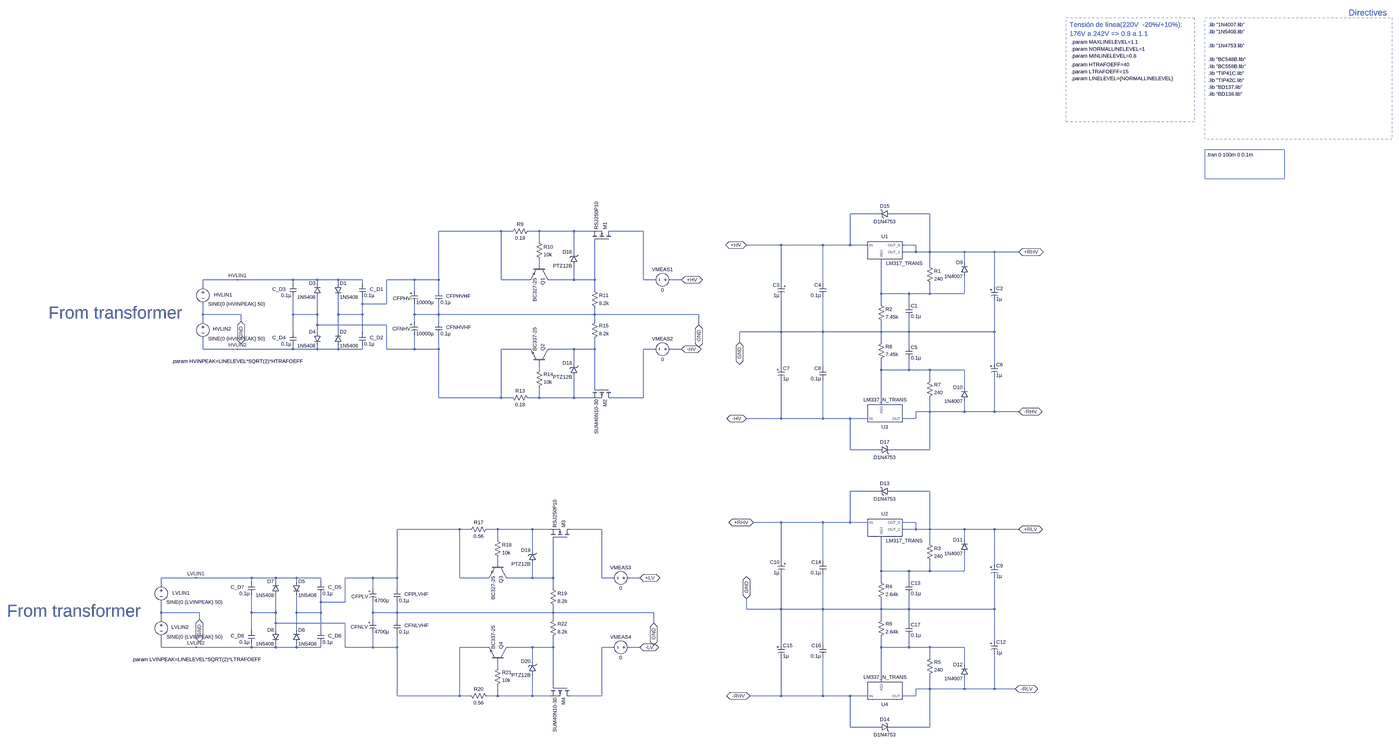
[diagram p0: schematic power_supply_V_1.0_BL.asc, whole sheet]
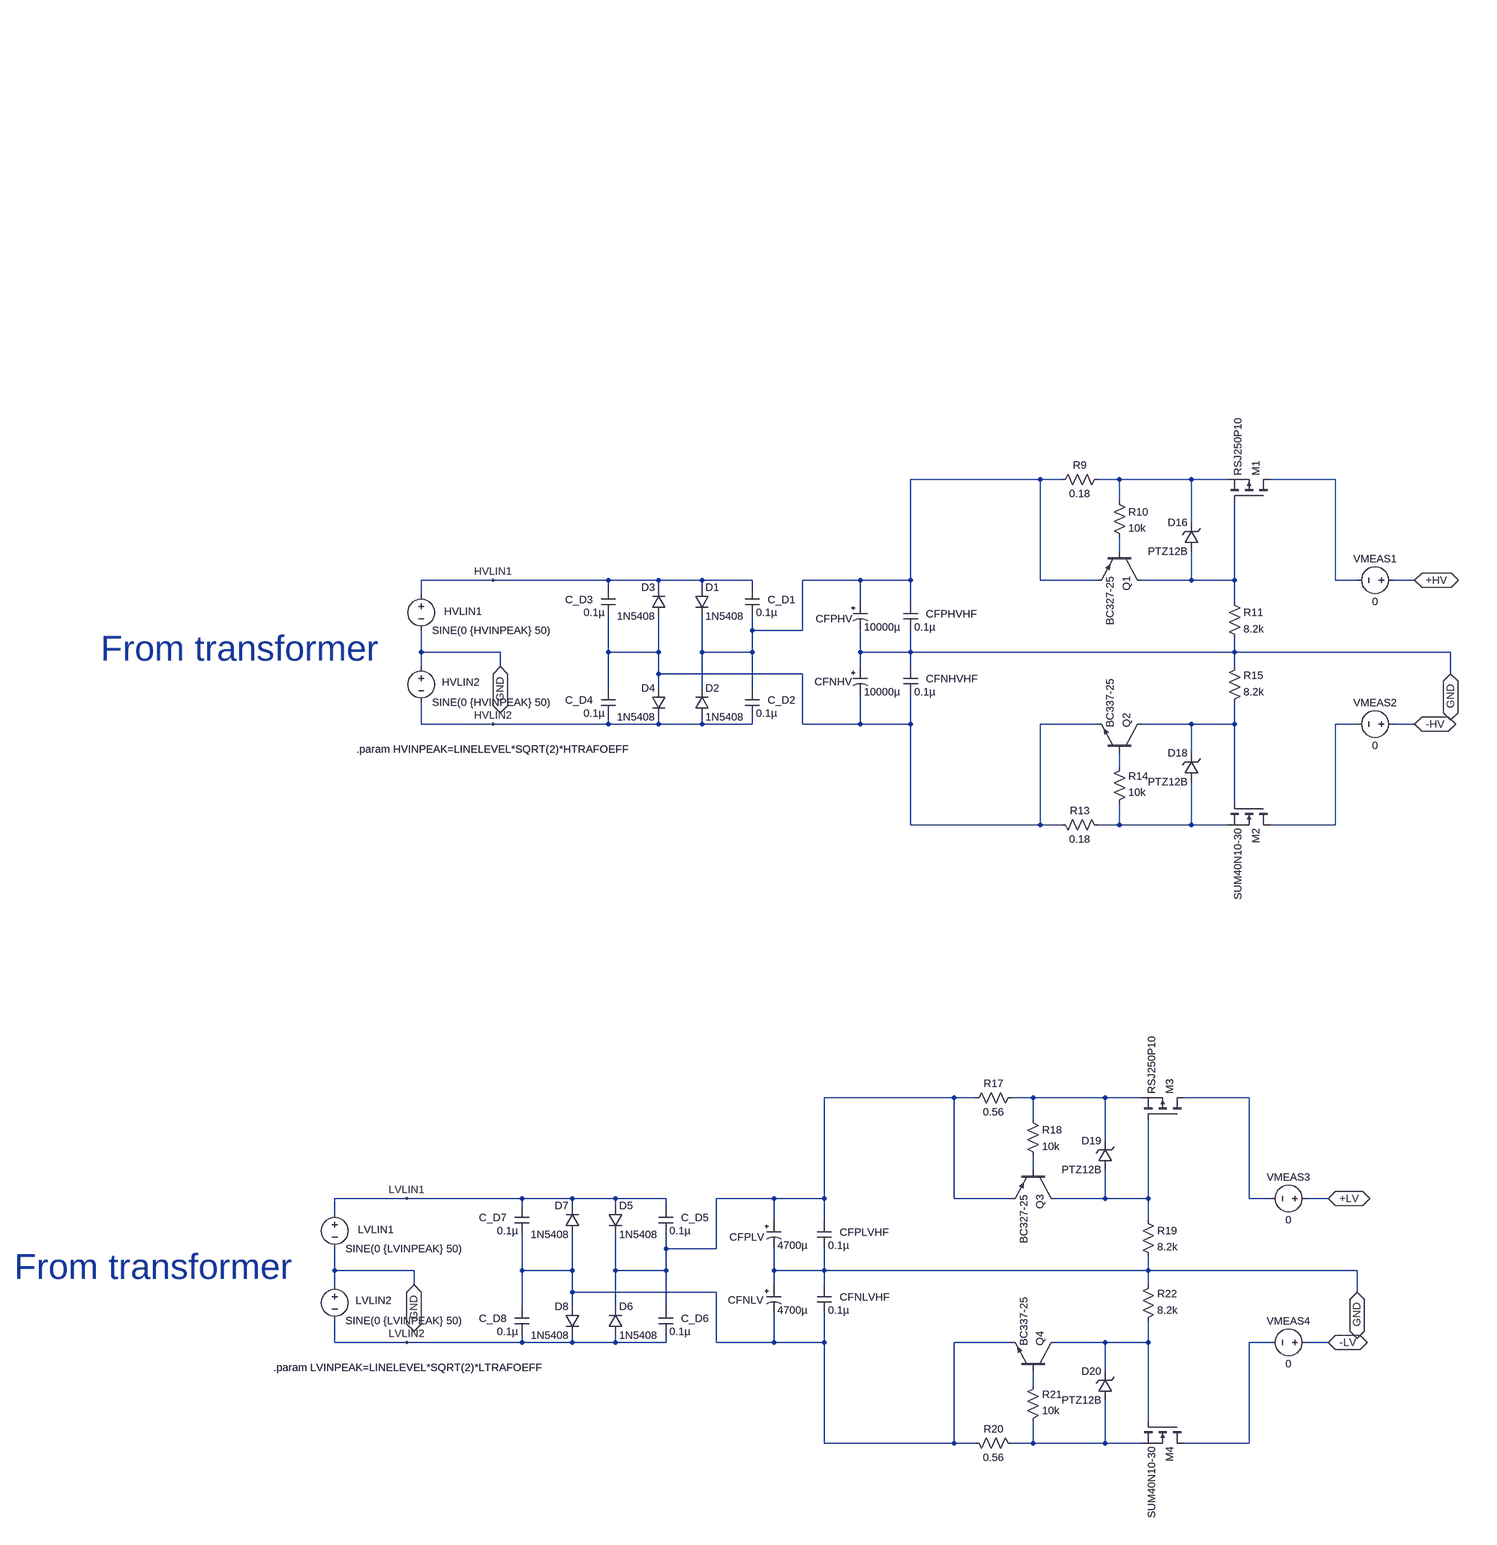
[diagram p1: schematic power_supply_V_1.0_BL.asc, part, row 1 of 1, column 1 of 2]
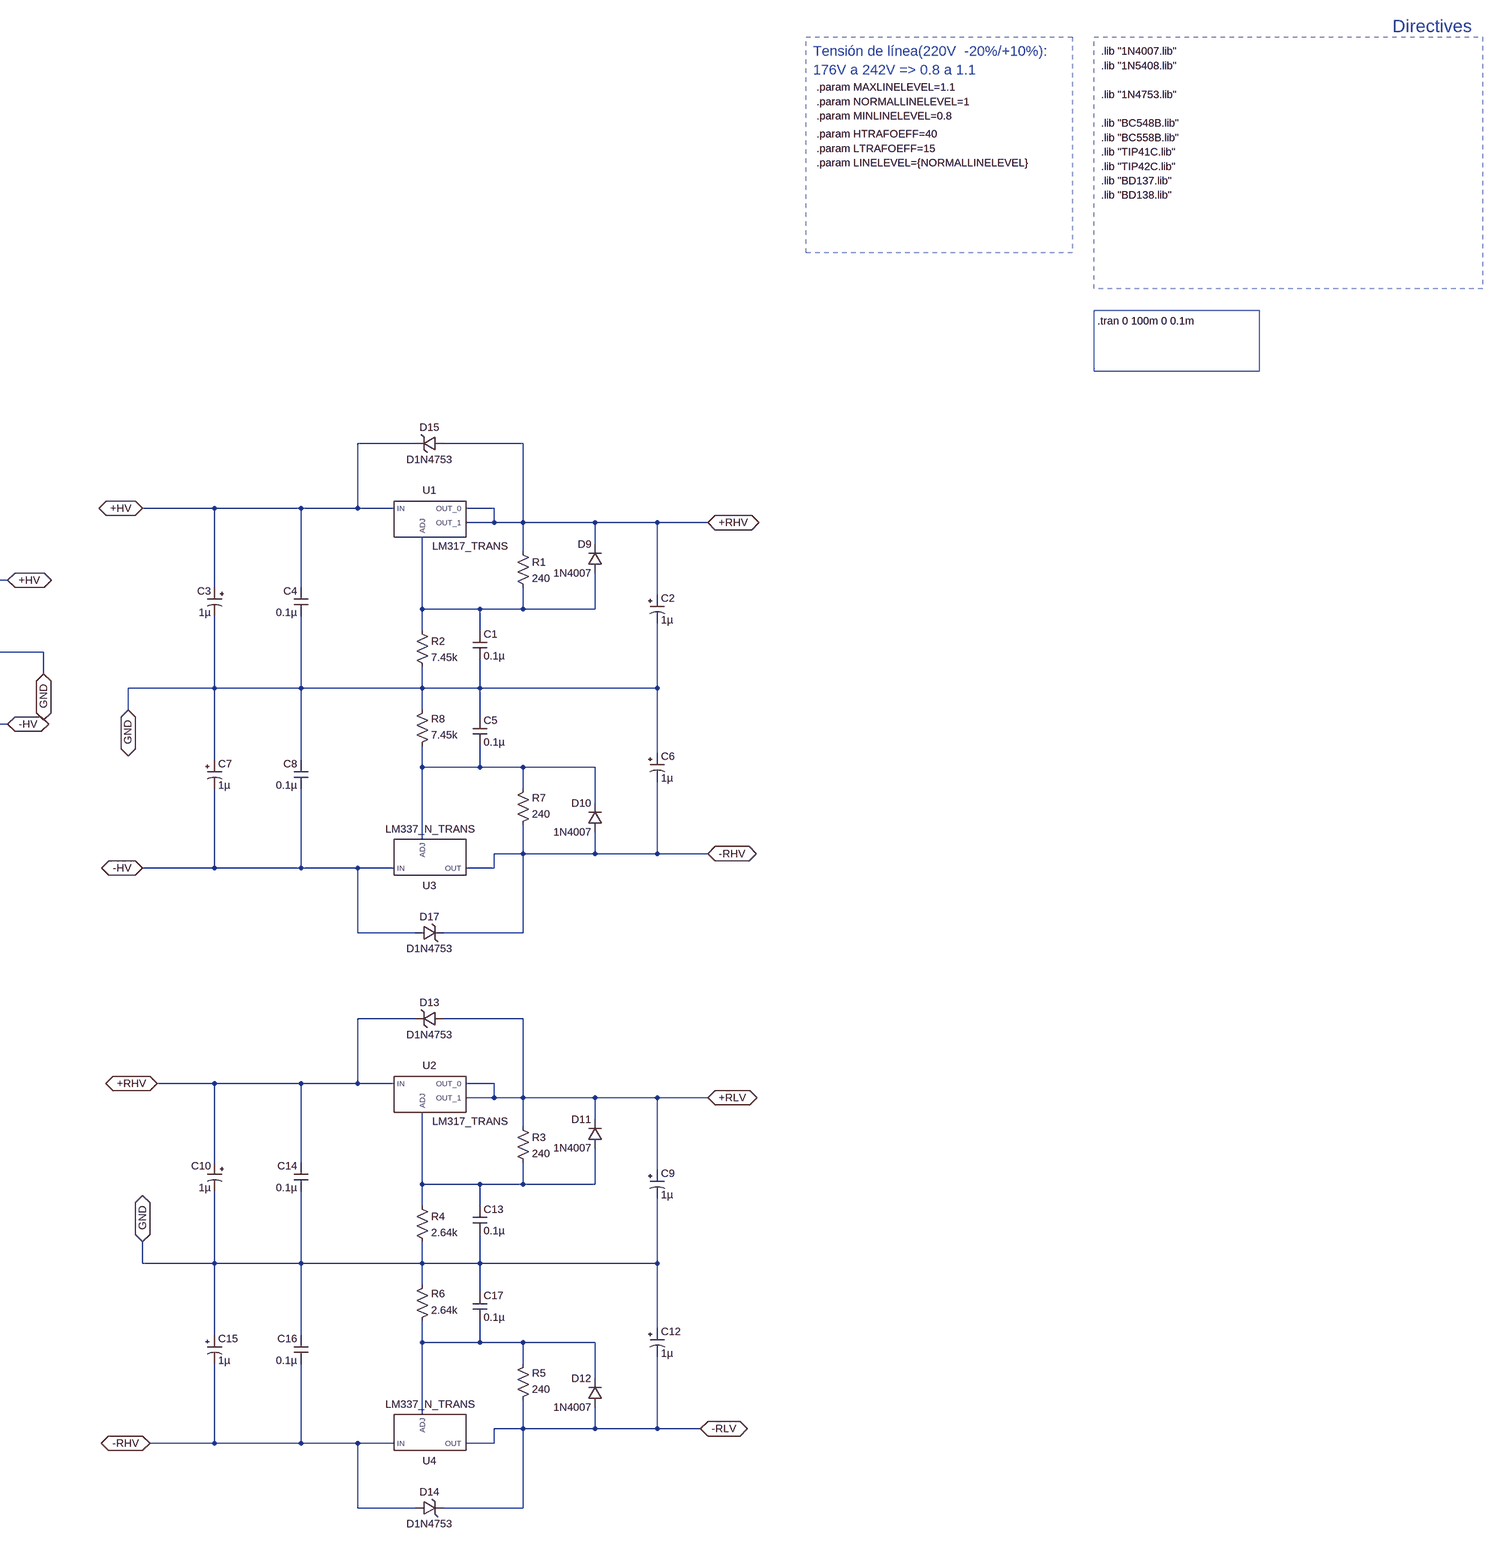
[diagram p2: schematic power_supply_V_1.0_BL.asc, part, row 1 of 1, column 2 of 2]
power_supply_V_1.0_BL.asc, the LTspice schematic file:
Version 4
SHEET 1 5728 3316
WIRE 1312 -320 1184 -320
WIRE 1552 -320 1376 -320
WIRE -784 -240 -1072 -240
WIRE -736 -240 -784 -240
WIRE -608 -240 -656 -240
WIRE -448 -240 -608 -240
WIRE -368 -240 -448 -240
WIRE -128 -240 -272 -240
WIRE -608 -192 -608 -240
WIRE 768 -176 608 -176
WIRE 960 -176 768 -176
WIRE 1184 -176 1184 -320
WIRE 1184 -176 960 -176
WIRE 1264 -176 1184 -176
WIRE 1488 -176 1424 -176
WIRE -448 -144 -448 -240
WIRE 1488 -144 1488 -176
WIRE 1488 -144 1424 -144
WIRE 1552 -144 1552 -320
WIRE 1552 -144 1488 -144
WIRE 1712 -144 1552 -144
WIRE 1872 -144 1712 -144
WIRE 1984 -144 1872 -144
WIRE 1712 -96 1712 -144
WIRE -608 -80 -608 -112
WIRE 1552 -80 1552 -144
WIRE -2000 -16 -2160 -16
WIRE -1744 -16 -2000 -16
WIRE -1632 -16 -1744 -16
WIRE -1536 -16 -1632 -16
WIRE -1424 -16 -1536 -16
WIRE -1184 -16 -1312 -16
WIRE -1072 -16 -1072 -240
WIRE -1072 -16 -1184 -16
WIRE -784 -16 -784 -240
WIRE -656 -16 -784 -16
WIRE -448 -16 -448 -80
WIRE -448 -16 -560 -16
WIRE -352 -16 -352 -192
WIRE -352 -16 -448 -16
WIRE -128 -16 -128 -240
WIRE -80 -16 -128 -16
WIRE 48 -16 0 -16
WIRE -1744 0 -1744 -16
WIRE -1632 0 -1632 -16
WIRE -1536 0 -1536 -16
WIRE -1424 0 -1424 -16
WIRE 768 0 768 -176
WIRE 960 0 960 -176
WIRE -2160 16 -2160 -16
WIRE 1872 16 1872 -144
WIRE -1184 32 -1184 -16
WIRE -1072 32 -1072 -16
WIRE -352 32 -352 -16
WIRE 1328 48 1328 -112
WIRE 1456 48 1328 48
WIRE 1552 48 1552 0
WIRE 1552 48 1456 48
WIRE 1712 48 1712 -32
WIRE 1712 48 1552 48
WIRE -1424 96 -1424 64
WIRE -1312 96 -1312 -16
WIRE -1312 96 -1424 96
WIRE 1328 96 1328 48
WIRE 1456 96 1456 48
WIRE -2160 144 -2160 96
WIRE -1984 144 -2160 144
WIRE -1744 144 -1744 64
WIRE -1632 144 -1632 64
WIRE -1632 144 -1744 144
WIRE -1536 144 -1536 64
WIRE -1424 144 -1424 96
WIRE -1424 144 -1536 144
WIRE -1184 144 -1184 96
WIRE -1072 144 -1072 96
WIRE -1072 144 -1184 144
WIRE -352 144 -352 112
WIRE -352 144 -1072 144
WIRE 128 144 -352 144
WIRE -2160 176 -2160 144
WIRE -1984 176 -1984 144
WIRE -1184 176 -1184 144
WIRE -1072 176 -1072 144
WIRE -352 176 -352 144
WIRE -1632 192 -1632 144
WIRE -1312 192 -1632 192
WIRE 128 192 128 144
WIRE -1744 224 -1744 144
WIRE -1632 224 -1632 192
WIRE -1536 224 -1536 144
WIRE -1424 224 -1424 144
WIRE 768 224 768 64
WIRE 768 224 576 224
WIRE 960 224 960 64
WIRE 960 224 768 224
WIRE 1328 224 1328 176
WIRE 1328 224 960 224
WIRE 1456 224 1456 160
WIRE 1456 224 1328 224
WIRE 1872 224 1872 80
WIRE 1872 224 1456 224
WIRE 576 272 576 224
WIRE 1328 272 1328 224
WIRE 1456 288 1456 224
WIRE -2160 304 -2160 256
WIRE -2000 304 -2160 304
WIRE -1744 304 -1744 288
WIRE -1744 304 -2000 304
WIRE -1632 304 -1632 288
WIRE -1632 304 -1744 304
WIRE -1536 304 -1536 288
WIRE -1536 304 -1632 304
WIRE -1424 304 -1424 288
WIRE -1424 304 -1536 304
WIRE -1312 304 -1312 192
WIRE -1184 304 -1184 240
WIRE -1184 304 -1312 304
WIRE -1072 304 -1072 240
WIRE -1072 304 -1184 304
WIRE -656 304 -784 304
WIRE -448 304 -560 304
WIRE -352 304 -352 256
WIRE -352 304 -448 304
WIRE -80 304 -128 304
WIRE 48 304 0 304
WIRE -448 368 -448 304
WIRE 1872 368 1872 224
WIRE 768 384 768 224
WIRE 960 384 960 224
WIRE -608 400 -608 368
WIRE 1328 400 1328 352
WIRE 1456 400 1456 352
WIRE 1456 400 1328 400
WIRE 1552 400 1456 400
WIRE 1712 400 1552 400
WIRE 1552 448 1552 400
WIRE -352 480 -352 304
WIRE 1712 480 1712 400
WIRE -1072 528 -1072 304
WIRE -784 528 -784 304
WIRE -784 528 -1072 528
WIRE -736 528 -784 528
WIRE -608 528 -608 480
WIRE -608 528 -656 528
WIRE -448 528 -448 432
WIRE -448 528 -608 528
WIRE -368 528 -448 528
WIRE -128 528 -128 304
WIRE -128 528 -272 528
WIRE 1328 560 1328 400
WIRE 1552 592 1552 528
WIRE 1552 592 1488 592
WIRE 1712 592 1712 544
WIRE 1712 592 1552 592
WIRE 1872 592 1872 432
WIRE 1872 592 1712 592
WIRE 1984 592 1872 592
WIRE 768 624 768 448
WIRE 768 624 608 624
WIRE 960 624 960 448
WIRE 960 624 768 624
WIRE 1184 624 960 624
WIRE 1264 624 1184 624
WIRE 1488 624 1488 592
WIRE 1488 624 1424 624
WIRE 1184 768 1184 624
WIRE 1312 768 1184 768
WIRE 1552 768 1552 592
WIRE 1552 768 1376 768
WIRE 1312 1104 1184 1104
WIRE 1552 1104 1376 1104
WIRE 768 1248 640 1248
WIRE 960 1248 768 1248
WIRE 1184 1248 1184 1104
WIRE 1184 1248 960 1248
WIRE 1264 1248 1184 1248
WIRE 1488 1248 1424 1248
WIRE -976 1280 -1264 1280
WIRE -928 1280 -976 1280
WIRE -800 1280 -848 1280
WIRE -640 1280 -800 1280
WIRE -560 1280 -640 1280
WIRE -320 1280 -464 1280
WIRE 1488 1280 1488 1248
WIRE 1488 1280 1424 1280
WIRE 1552 1280 1552 1104
WIRE 1552 1280 1488 1280
WIRE 1712 1280 1552 1280
WIRE 1872 1280 1712 1280
WIRE 1984 1280 1872 1280
WIRE -800 1328 -800 1280
WIRE 1712 1328 1712 1280
WIRE 1552 1344 1552 1280
WIRE -640 1376 -640 1280
WIRE 768 1424 768 1248
WIRE 960 1424 960 1248
WIRE -800 1440 -800 1408
WIRE 1872 1440 1872 1280
WIRE 1328 1472 1328 1312
WIRE 1456 1472 1328 1472
WIRE 1552 1472 1552 1424
WIRE 1552 1472 1456 1472
WIRE 1712 1472 1712 1392
WIRE 1712 1472 1552 1472
WIRE -2192 1504 -2352 1504
WIRE -1936 1504 -2192 1504
WIRE -1824 1504 -1936 1504
WIRE -1728 1504 -1824 1504
WIRE -1616 1504 -1728 1504
WIRE -1376 1504 -1504 1504
WIRE -1264 1504 -1264 1280
WIRE -1264 1504 -1376 1504
WIRE -976 1504 -976 1280
WIRE -848 1504 -976 1504
WIRE -640 1504 -640 1440
WIRE -640 1504 -752 1504
WIRE -544 1504 -544 1328
WIRE -544 1504 -640 1504
WIRE -320 1504 -320 1280
WIRE -272 1504 -320 1504
WIRE -144 1504 -192 1504
WIRE -1936 1520 -1936 1504
WIRE -1824 1520 -1824 1504
WIRE -1728 1520 -1728 1504
WIRE -1616 1520 -1616 1504
WIRE 1328 1520 1328 1472
WIRE 1456 1520 1456 1472
WIRE -2352 1536 -2352 1504
WIRE -1376 1552 -1376 1504
WIRE -1264 1552 -1264 1504
WIRE -544 1552 -544 1504
WIRE -1616 1616 -1616 1584
WIRE -1504 1616 -1504 1504
WIRE -1504 1616 -1616 1616
WIRE 608 1648 608 1600
WIRE 768 1648 768 1488
WIRE 768 1648 608 1648
WIRE 960 1648 960 1488
WIRE 960 1648 768 1648
WIRE 1328 1648 1328 1600
WIRE 1328 1648 960 1648
WIRE 1456 1648 1456 1584
WIRE 1456 1648 1328 1648
WIRE 1872 1648 1872 1504
WIRE 1872 1648 1456 1648
WIRE -2352 1664 -2352 1616
WIRE -2176 1664 -2352 1664
WIRE -1936 1664 -1936 1584
WIRE -1824 1664 -1824 1584
WIRE -1824 1664 -1936 1664
WIRE -1728 1664 -1728 1584
WIRE -1616 1664 -1616 1616
WIRE -1616 1664 -1728 1664
WIRE -1376 1664 -1376 1616
WIRE -1264 1664 -1264 1616
WIRE -1264 1664 -1376 1664
WIRE -544 1664 -544 1632
WIRE -544 1664 -1264 1664
WIRE -80 1664 -544 1664
WIRE -2352 1696 -2352 1664
WIRE -2176 1696 -2176 1664
WIRE -1376 1696 -1376 1664
WIRE -1264 1696 -1264 1664
WIRE -544 1696 -544 1664
WIRE 1328 1696 1328 1648
WIRE -1824 1712 -1824 1664
WIRE -1504 1712 -1824 1712
WIRE -80 1712 -80 1664
WIRE 1456 1712 1456 1648
WIRE -1936 1744 -1936 1664
WIRE -1824 1744 -1824 1712
WIRE -1728 1744 -1728 1664
WIRE -1616 1744 -1616 1664
WIRE 1872 1792 1872 1648
WIRE 768 1808 768 1648
WIRE 960 1808 960 1648
WIRE -2352 1824 -2352 1776
WIRE -2192 1824 -2352 1824
WIRE -1936 1824 -1936 1808
WIRE -1936 1824 -2192 1824
WIRE -1824 1824 -1824 1808
WIRE -1824 1824 -1936 1824
WIRE -1728 1824 -1728 1808
WIRE -1728 1824 -1824 1824
WIRE -1616 1824 -1616 1808
WIRE -1616 1824 -1728 1824
WIRE -1504 1824 -1504 1712
WIRE -1376 1824 -1376 1760
WIRE -1376 1824 -1504 1824
WIRE -1264 1824 -1264 1760
WIRE -1264 1824 -1376 1824
WIRE -848 1824 -976 1824
WIRE -640 1824 -752 1824
WIRE -544 1824 -544 1776
WIRE -544 1824 -640 1824
WIRE -272 1824 -320 1824
WIRE -144 1824 -192 1824
WIRE 1328 1824 1328 1776
WIRE 1456 1824 1456 1776
WIRE 1456 1824 1328 1824
WIRE 1552 1824 1456 1824
WIRE 1712 1824 1552 1824
WIRE 1552 1872 1552 1824
WIRE -640 1888 -640 1824
WIRE 1712 1904 1712 1824
WIRE -800 1920 -800 1888
WIRE 1328 1984 1328 1824
WIRE -544 2000 -544 1824
WIRE 1552 2016 1552 1952
WIRE 1552 2016 1488 2016
WIRE 1712 2016 1712 1968
WIRE 1712 2016 1552 2016
WIRE 1872 2016 1872 1856
WIRE 1872 2016 1712 2016
WIRE 1968 2016 1872 2016
WIRE -1264 2048 -1264 1824
WIRE -976 2048 -976 1824
WIRE -976 2048 -1264 2048
WIRE -928 2048 -976 2048
WIRE -800 2048 -800 2000
WIRE -800 2048 -848 2048
WIRE -640 2048 -640 1952
WIRE -640 2048 -800 2048
WIRE -560 2048 -640 2048
WIRE -320 2048 -320 1824
WIRE -320 2048 -464 2048
WIRE 768 2048 768 1872
WIRE 768 2048 624 2048
WIRE 960 2048 960 1872
WIRE 960 2048 768 2048
WIRE 1184 2048 960 2048
WIRE 1264 2048 1184 2048
WIRE 1488 2048 1488 2016
WIRE 1488 2048 1424 2048
WIRE 1184 2192 1184 2048
WIRE 1312 2192 1184 2192
WIRE 1552 2192 1552 2016
WIRE 1552 2192 1376 2192
FLAG -2000 -16 HVLIN1
FLAG -2000 304 HVLIN2
FLAG 48 -16 +HV
IOPIN 48 -16 BiDir
FLAG 608 -176 +HV
IOPIN 608 -176 BiDir
FLAG 48 304 -HV
IOPIN 48 304 BiDir
FLAG 608 624 -HV
IOPIN 608 624 BiDir
FLAG 1984 -144 +RHV
IOPIN 1984 -144 BiDir
FLAG 1984 592 -RHV
IOPIN 1984 592 BiDir
FLAG 640 1248 +RHV
IOPIN 640 1248 BiDir
FLAG 624 2048 -RHV
IOPIN 624 2048 BiDir
FLAG 1984 1280 +RLV
IOPIN 1984 1280 BiDir
FLAG 1968 2016 -RLV
IOPIN 1968 2016 BiDir
FLAG -2192 1504 LVLIN1
FLAG -2192 1824 LVLIN2
FLAG -144 1504 +LV
IOPIN -144 1504 BiDir
FLAG -144 1824 -LV
IOPIN -144 1824 BiDir
FLAG -1984 176 GND
IOPIN -1984 176 BiDir
FLAG -2176 1696 GND
IOPIN -2176 1696 BiDir
FLAG 128 192 GND
IOPIN 128 192 BiDir
FLAG -80 1712 GND
IOPIN -80 1712 BiDir
FLAG 576 272 GND
IOPIN 576 272 BiDir
FLAG 608 1600 GND
IOPIN 608 1600 BiDir
SYMBOL voltage -2160 0 R0
WINDOW 123 0 0 Left 2
WINDOW 39 0 0 Left 2
WINDOW 0 51 53 Left 2
SYMATTR InstName HVLIN1
SYMATTR Value SINE(0 {HVINPEAK} 50)
SYMBOL diode -1552 0 R0
SYMATTR InstName D1
SYMATTR Value 1N5408
SYMBOL diode -1552 288 M180
WINDOW 0 24 64 Left 2
WINDOW 3 24 0 Left 2
SYMATTR InstName D2
SYMATTR Value 1N5408
SYMBOL polcap -1200 32 R0
WINDOW 0 -83 38 Left 2
WINDOW 3 24 56 Left 2
SYMATTR InstName CFPHV
SYMATTR Value 10000µ
SYMATTR Description Capacitor
SYMATTR Type cap
SYMATTR SpiceLine V=35 Irms=1.45 Rser=0.044 Lser=0 mfg="Nichicon" pn="UPR1V222MRH" type="Al electrolytic"
SYMBOL cap -1088 32 R0
WINDOW 0 50 27 Left 2
SYMATTR InstName CFPHVHF
SYMATTR Value 0.1µ
SYMATTR SpiceLine V=4 Irms=1.62 Rser=0.0464862 Lser=0 mfg="KEMET" pn="C0402C104K7PAC" type="X5R"
SYMBOL diode -1616 64 R180
WINDOW 0 24 64 Left 2
WINDOW 3 24 0 Left 2
SYMATTR InstName D3
SYMATTR Value 1N5408
SYMBOL diode -1616 224 M0
SYMATTR InstName D4
SYMATTR Value 1N5408
SYMBOL voltage -2160 160 R0
WINDOW 123 0 0 Left 2
WINDOW 39 0 0 Left 2
WINDOW 0 46 51 Left 2
SYMATTR InstName HVLIN2
SYMATTR Value SINE(0 {HVINPEAK} 50)
SYMBOL polcap -1200 176 R0
WINDOW 0 -86 34 Left 2
WINDOW 3 24 56 Left 2
SYMATTR InstName CFNHV
SYMATTR Value 10000µ
SYMATTR Description Capacitor
SYMATTR Type cap
SYMATTR SpiceLine V=35 Irms=1.45 Rser=0.044 Lser=0 mfg="Nichicon" pn="UPR1V222MRH" type="Al electrolytic"
SYMBOL cap -1088 176 R0
WINDOW 0 50 27 Left 2
SYMATTR InstName CFNHVHF
SYMATTR Value 0.1µ
SYMATTR SpiceLine V=4 Irms=1.62 Rser=0.0464862 Lser=0 mfg="KEMET" pn="C0402C104K7PAC" type="X5R"
SYMBOL LM317_TRANS 1344 -160 R0
WINDOW 3 91 53 Top 2
SYMATTR InstName U1
SYMBOL diode 1728 -32 R180
WINDOW 0 24 64 Left 2
WINDOW 3 24 0 Left 2
SYMATTR InstName D9
SYMATTR Value 1N4007
SYMBOL res 1536 -96 R0
SYMATTR InstName R1
SYMATTR Value 240
SYMBOL res 1312 80 R0
SYMATTR InstName R2
SYMATTR Value 7.45k
SYMBOL polcap 1856 16 R0
SYMATTR InstName C2
SYMATTR Value 1µ
SYMBOL polcap 784 0 M0
SYMATTR InstName C3
SYMATTR Value 1µ
SYMBOL diode 1728 544 R180
WINDOW 0 24 64 Left 2
WINDOW 3 24 0 Left 2
SYMATTR InstName D10
SYMATTR Value 1N4007
SYMBOL res 1536 544 M180
WINDOW 0 36 76 Left 2
WINDOW 3 36 40 Left 2
SYMATTR InstName R7
SYMATTR Value 240
SYMBOL res 1312 368 M180
WINDOW 0 36 76 Left 2
WINDOW 3 36 40 Left 2
SYMATTR InstName R8
SYMATTR Value 7.45k
SYMBOL polcap 1856 368 R0
SYMATTR InstName C6
SYMATTR Value 1µ
SYMBOL LM337_N_TRANS 1344 608 M180
SYMATTR InstName U3
SYMBOL cap 1440 96 R0
SYMATTR InstName C1
SYMATTR Value 0.1µ
SYMBOL cap 976 0 M0
SYMATTR InstName C4
SYMATTR Value 0.1µ
SYMBOL polcap 752 384 R0
SYMATTR InstName C7
SYMATTR Value 1µ
SYMBOL cap 976 448 R180
WINDOW 0 24 56 Left 2
WINDOW 3 24 8 Left 2
SYMATTR InstName C8
SYMATTR Value 0.1µ
SYMBOL cap 1440 352 M180
WINDOW 0 24 56 Left 2
WINDOW 3 24 8 Left 2
SYMATTR InstName C5
SYMATTR Value 0.1µ
SYMBOL cap -1440 0 R0
WINDOW 0 50 27 Left 2
SYMATTR InstName C_D1
SYMATTR Value 0.1µ
SYMATTR SpiceLine V=4 Irms=1.62 Rser=0.0464862 Lser=0 mfg="KEMET" pn="C0402C104K7PAC" type="X5R"
SYMBOL cap -1440 224 R0
WINDOW 0 50 27 Left 2
SYMATTR InstName C_D2
SYMATTR Value 0.1µ
SYMATTR SpiceLine V=4 Irms=1.62 Rser=0.0464862 Lser=0 mfg="KEMET" pn="C0402C104K7PAC" type="X5R"
SYMBOL cap -1728 0 M0
WINDOW 0 50 27 Left 2
SYMATTR InstName C_D3
SYMATTR Value 0.1µ
SYMATTR SpiceLine V=4 Irms=1.62 Rser=0.0464862 Lser=0 mfg="KEMET" pn="C0402C104K7PAC" type="X5R"
SYMBOL cap -1728 224 M0
WINDOW 0 50 27 Left 2
SYMATTR InstName C_D4
SYMATTR Value 0.1µ
SYMATTR SpiceLine V=4 Irms=1.62 Rser=0.0464862 Lser=0 mfg="KEMET" pn="C0402C104K7PAC" type="X5R"
SYMBOL zener 1376 -336 R90
WINDOW 0 -4 32 VBottom 2
WINDOW 3 36 32 VTop 2
SYMATTR InstName D15
SYMATTR Value D1N4753
SYMBOL zener 1312 784 R270
WINDOW 0 36 32 VTop 2
WINDOW 3 -4 32 VBottom 2
SYMATTR InstName D17
SYMATTR Value D1N4753
SYMBOL LM317_TRANS 1344 1264 R0
WINDOW 3 91 53 Top 2
SYMATTR InstName U2
SYMBOL diode 1728 1392 R180
WINDOW 0 24 64 Left 2
WINDOW 3 24 0 Left 2
SYMATTR InstName D11
SYMATTR Value 1N4007
SYMBOL res 1536 1328 R0
SYMATTR InstName R3
SYMATTR Value 240
SYMBOL res 1312 1504 R0
SYMATTR InstName R4
SYMATTR Value 2.64k
SYMBOL polcap 1856 1440 R0
SYMATTR InstName C9
SYMATTR Value 1µ
SYMBOL polcap 784 1424 M0
SYMATTR InstName C10
SYMATTR Value 1µ
SYMBOL diode 1728 1968 R180
WINDOW 0 24 64 Left 2
WINDOW 3 24 0 Left 2
SYMATTR InstName D12
SYMATTR Value 1N4007
SYMBOL res 1536 1968 M180
WINDOW 0 36 76 Left 2
WINDOW 3 36 40 Left 2
SYMATTR InstName R5
SYMATTR Value 240
SYMBOL res 1312 1792 M180
WINDOW 0 36 76 Left 2
WINDOW 3 36 40 Left 2
SYMATTR InstName R6
SYMATTR Value 2.64k
SYMBOL polcap 1856 1792 R0
SYMATTR InstName C12
SYMATTR Value 1µ
SYMBOL LM337_N_TRANS 1344 2032 M180
SYMATTR InstName U4
SYMBOL cap 1440 1520 R0
SYMATTR InstName C13
SYMATTR Value 0.1µ
SYMBOL cap 976 1424 M0
SYMATTR InstName C14
SYMATTR Value 0.1µ
SYMBOL polcap 752 1808 R0
SYMATTR InstName C15
SYMATTR Value 1µ
SYMBOL cap 976 1872 R180
WINDOW 0 24 56 Left 2
WINDOW 3 24 8 Left 2
SYMATTR InstName C16
SYMATTR Value 0.1µ
SYMBOL cap 1440 1776 M180
WINDOW 0 24 56 Left 2
WINDOW 3 24 8 Left 2
SYMATTR InstName C17
SYMATTR Value 0.1µ
SYMBOL zener 1376 1088 R90
WINDOW 0 -4 32 VBottom 2
WINDOW 3 36 32 VTop 2
SYMATTR InstName D13
SYMATTR Value D1N4753
SYMBOL zener 1312 2208 R270
WINDOW 0 36 32 VTop 2
WINDOW 3 -4 32 VBottom 2
SYMATTR InstName D14
SYMATTR Value D1N4753
SYMBOL voltage -2352 1520 R0
WINDOW 123 0 0 Left 2
WINDOW 39 0 0 Left 2
WINDOW 0 51 53 Left 2
SYMATTR InstName LVLIN1
SYMATTR Value SINE(0 {LVINPEAK} 50)
SYMBOL diode -1744 1520 R0
SYMATTR InstName D5
SYMATTR Value 1N5408
SYMBOL diode -1744 1808 M180
WINDOW 0 24 64 Left 2
WINDOW 3 24 0 Left 2
SYMATTR InstName D6
SYMATTR Value 1N5408
SYMBOL polcap -1392 1552 R0
WINDOW 0 -83 38 Left 2
WINDOW 3 24 56 Left 2
SYMATTR InstName CFPLV
SYMATTR Value 4700µ
SYMATTR Description Capacitor
SYMATTR Type cap
SYMATTR SpiceLine V=35 Irms=1.45 Rser=0.044 Lser=0 mfg="Nichicon" pn="UPR1V222MRH" type="Al electrolytic"
SYMBOL cap -1280 1552 R0
WINDOW 0 50 27 Left 2
SYMATTR InstName CFPLVHF
SYMATTR Value 0.1µ
SYMATTR SpiceLine V=4 Irms=1.62 Rser=0.0464862 Lser=0 mfg="KEMET" pn="C0402C104K7PAC" type="X5R"
SYMBOL diode -1808 1584 R180
WINDOW 0 24 64 Left 2
WINDOW 3 24 0 Left 2
SYMATTR InstName D7
SYMATTR Value 1N5408
SYMBOL diode -1808 1744 M0
SYMATTR InstName D8
SYMATTR Value 1N5408
SYMBOL voltage -2352 1680 R0
WINDOW 123 0 0 Left 2
WINDOW 39 0 0 Left 2
WINDOW 0 46 51 Left 2
SYMATTR InstName LVLIN2
SYMATTR Value SINE(0 {LVINPEAK} 50)
SYMBOL polcap -1392 1696 R0
WINDOW 0 -86 34 Left 2
WINDOW 3 24 56 Left 2
SYMATTR InstName CFNLV
SYMATTR Value 4700µ
SYMATTR Description Capacitor
SYMATTR Type cap
SYMATTR SpiceLine V=35 Irms=1.45 Rser=0.044 Lser=0 mfg="Nichicon" pn="UPR1V222MRH" type="Al electrolytic"
SYMBOL cap -1280 1696 R0
WINDOW 0 50 27 Left 2
SYMATTR InstName CFNLVHF
SYMATTR Value 0.1µ
SYMATTR SpiceLine V=4 Irms=1.62 Rser=0.0464862 Lser=0 mfg="KEMET" pn="C0402C104K7PAC" type="X5R"
SYMBOL cap -1632 1520 R0
WINDOW 0 50 27 Left 2
SYMATTR InstName C_D5
SYMATTR Value 0.1µ
SYMATTR SpiceLine V=4 Irms=1.62 Rser=0.0464862 Lser=0 mfg="KEMET" pn="C0402C104K7PAC" type="X5R"
SYMBOL cap -1632 1744 R0
WINDOW 0 50 27 Left 2
SYMATTR InstName C_D6
SYMATTR Value 0.1µ
SYMATTR SpiceLine V=4 Irms=1.62 Rser=0.0464862 Lser=0 mfg="KEMET" pn="C0402C104K7PAC" type="X5R"
SYMBOL cap -1920 1520 M0
WINDOW 0 50 27 Left 2
SYMATTR InstName C_D7
SYMATTR Value 0.1µ
SYMATTR SpiceLine V=4 Irms=1.62 Rser=0.0464862 Lser=0 mfg="KEMET" pn="C0402C104K7PAC" type="X5R"
SYMBOL cap -1920 1744 M0
WINDOW 0 50 27 Left 2
SYMATTR InstName C_D8
SYMATTR Value 0.1µ
SYMATTR SpiceLine V=4 Irms=1.62 Rser=0.0464862 Lser=0 mfg="KEMET" pn="C0402C104K7PAC" type="X5R"
SYMBOL voltage 16 -16 R90
WINDOW 0 -32 56 VBottom 2
WINDOW 3 32 56 VTop 2
SYMATTR InstName VMEAS1
SYMATTR Value 0
SYMBOL voltage 16 304 R90
WINDOW 0 -32 56 VBottom 2
WINDOW 3 32 56 VTop 2
SYMATTR InstName VMEAS2
SYMATTR Value 0
SYMBOL voltage -176 1504 R90
WINDOW 0 -32 56 VBottom 2
WINDOW 3 32 56 VTop 2
SYMATTR InstName VMEAS3
SYMATTR Value 0
SYMBOL voltage -176 1824 R90
WINDOW 0 -32 56 VBottom 2
WINDOW 3 32 56 VTop 2
SYMATTR InstName VMEAS4
SYMATTR Value 0
SYMBOL pnp -560 -80 R90
SYMATTR InstName Q1
SYMATTR Value BC327-25
SYMBOL res -640 -256 R90
WINDOW 0 0 56 VBottom 2
WINDOW 3 32 56 VTop 2
SYMATTR InstName R9
SYMATTR Value 0.18
SYMBOL res -624 -208 R0
SYMATTR InstName R10
SYMATTR Value 10k
SYMBOL res -368 16 R0
SYMATTR InstName R11
SYMATTR Value 8.2k
SYMBOL zener -432 -80 R180
WINDOW 0 24 64 Left 2
WINDOW 3 24 0 Left 2
SYMATTR InstName D16
SYMATTR Value PTZ12B
SYMBOL res -640 544 M270
WINDOW 0 32 56 VTop 2
WINDOW 3 0 56 VBottom 2
SYMATTR InstName R13
SYMATTR Value 0.18
SYMBOL res -624 496 M180
WINDOW 0 36 76 Left 2
WINDOW 3 36 40 Left 2
SYMATTR InstName R14
SYMATTR Value 10k
SYMBOL res -368 272 M180
WINDOW 0 36 76 Left 2
WINDOW 3 36 40 Left 2
SYMATTR InstName R15
SYMATTR Value 8.2k
SYMBOL zener -432 432 R180
WINDOW 0 24 64 Left 2
WINDOW 3 24 0 Left 2
SYMATTR InstName D18
SYMATTR Value PTZ12B
SYMBOL npn -560 368 M270
SYMATTR InstName Q2
SYMATTR Value BC337-25
SYMBOL pmos -272 -192 M270
SYMATTR InstName M1
SYMATTR Value RSJ250P10
SYMBOL nmos -272 480 R90
SYMATTR InstName M2
SYMATTR Value SUM40N10-30
SYMBOL pnp -752 1440 R90
SYMATTR InstName Q3
SYMATTR Value BC327-25
SYMBOL res -832 1264 R90
WINDOW 0 0 56 VBottom 2
WINDOW 3 32 56 VTop 2
SYMATTR InstName R17
SYMATTR Value 0.56
SYMBOL res -816 1312 R0
SYMATTR InstName R18
SYMATTR Value 10k
SYMBOL res -560 1536 R0
SYMATTR InstName R19
SYMATTR Value 8.2k
SYMBOL zener -624 1440 R180
WINDOW 0 24 64 Left 2
WINDOW 3 24 0 Left 2
SYMATTR InstName D19
SYMATTR Value PTZ12B
SYMBOL res -832 2064 M270
WINDOW 0 32 56 VTop 2
WINDOW 3 0 56 VBottom 2
SYMATTR InstName R20
SYMATTR Value 0.56
SYMBOL res -816 2016 M180
WINDOW 0 36 76 Left 2
WINDOW 3 36 40 Left 2
SYMATTR InstName R21
SYMATTR Value 10k
SYMBOL res -560 1792 M180
WINDOW 0 36 76 Left 2
WINDOW 3 36 40 Left 2
SYMATTR InstName R22
SYMATTR Value 8.2k
SYMBOL zener -624 1952 R180
WINDOW 0 24 64 Left 2
WINDOW 3 24 0 Left 2
SYMATTR InstName D20
SYMATTR Value PTZ12B
SYMBOL npn -752 1888 M270
SYMATTR InstName Q4
SYMATTR Value BC337-25
SYMBOL pmos -464 1328 M270
SYMATTR InstName M3
SYMATTR Value RSJ250P10
SYMBOL nmos -464 2000 R90
SYMATTR InstName M4
SYMATTR Value SUM40N10-30
TEXT -2872 136 Left 6 ;From transformer
TEXT 3832 -1064 Left 2 !.tran 0 100m 0 0.1m
TEXT 3840 -1664 Left 2 !.lib "1N4007.lib"
TEXT 4488 -1720 Left 4 ;Directives
TEXT 3840 -1632 Left 2 !.lib "1N5408.lib"
TEXT 3840 -1568 Left 2 !.lib "1N4753.lib"
TEXT 3208 -1480 Left 2 !.param HTRAFOEFF=40
TEXT 3208 -1448 Left 2 !.param LTRAFOEFF=15
TEXT 3208 -1416 Left 2 !.param LINELEVEL={NORMALLINELEVEL}
TEXT 3200 -1664 Left 3 ;Tensión de línea(220V  -20%/+10%):\n176V a 242V => 0.8 a 1.1
TEXT 3208 -1584 Left 2 !.param MAXLINELEVEL=1.1
TEXT 3208 -1520 Left 2 !.param MINLINELEVEL=0.8
TEXT 3208 -1552 Left 2 !.param NORMALLINELEVEL=1
TEXT -2304 360 Left 2 !.param HVINPEAK=LINELEVEL*SQRT(2)*HTRAFOEFF
TEXT -2488 1880 Left 2 !.param LVINPEAK=LINELEVEL*SQRT(2)*LTRAFOEFF
TEXT 3840 -1504 Left 2 !.lib "BC548B.lib"
TEXT 3840 -1472 Left 2 !.lib "BC558B.lib"
TEXT 3840 -1440 Left 2 !.lib "TIP41C.lib"
TEXT 3840 -1408 Left 2 !.lib "TIP42C.lib"
TEXT -3064 1656 Left 6 ;From transformer
TEXT 3840 -1376 Left 2 !.lib "BD137.lib"
TEXT 3840 -1344 Left 2 !.lib "BD138.lib"
RECTANGLE Normal 4688 -1136 3824 -1696 3
RECTANGLE Normal 3776 -1216 3184 -1696 2
RECTANGLE Normal 4192 -928 3824 -1088

The netlist it stands for:
* power_supply_V_1.0_BL.asc
V§HVLIN1 HVLIN1 GND SINE(0 {HVINPEAK} 50)
D1 HVLIN1 N001 1N5408
D2 HVLIN2 N001 1N5408
CFPHV N001 GND 10000µ V=35 Irms=1.45 Rser=0.044 Lser=0 mfg="Nichicon" pn="UPR1V222MRH" type="Al electrolytic"
CFPHVHF N001 GND 0.1µ V=4 Irms=1.62 Rser=0.0464862 Lser=0 mfg="KEMET" pn="C0402C104K7PAC" type="X5R"
D3 N007 HVLIN1 1N5408
D4 N007 HVLIN2 1N5408
V§HVLIN2 GND HVLIN2 SINE(0 {HVINPEAK} 50)
CFNHV GND N007 10000µ V=35 Irms=1.45 Rser=0.044 Lser=0 mfg="Nichicon" pn="UPR1V222MRH" type="Al electrolytic"
CFNHVHF GND N007 0.1µ V=4 Irms=1.62 Rser=0.0464862 Lser=0 mfg="KEMET" pn="C0402C104K7PAC" type="X5R"
XU1 +HV N006 +RHV +RHV LM317_TRANS  ; pins IN ADJ OUT_0 OUT_1
D9 N006 +RHV 1N4007
R1 +RHV N006 240
R2 N006 GND 7.45k
C2 +RHV GND 1µ
C3 +HV GND 1µ
D10 -RHV N011 1N4007
R7 -RHV N011 240
R8 N011 GND 7.45k
C6 GND -RHV 1µ
XU3 -HV N011 -RHV LM337_N_TRANS  ; pins IN ADJ OUT
C1 N006 GND 0.1µ
C4 +HV GND 0.1µ
C7 GND -HV 1µ
C8 -HV GND 0.1µ
C5 N011 GND 0.1µ
C_D1 HVLIN1 N001 0.1µ V=4 Irms=1.62 Rser=0.0464862 Lser=0 mfg="KEMET" pn="C0402C104K7PAC" type="X5R"
C_D2 N001 HVLIN2 0.1µ V=4 Irms=1.62 Rser=0.0464862 Lser=0 mfg="KEMET" pn="C0402C104K7PAC" type="X5R"
C_D3 HVLIN1 N007 0.1µ V=4 Irms=1.62 Rser=0.0464862 Lser=0 mfg="KEMET" pn="C0402C104K7PAC" type="X5R"
C_D4 N007 HVLIN2 0.1µ V=4 Irms=1.62 Rser=0.0464862 Lser=0 mfg="KEMET" pn="C0402C104K7PAC" type="X5R"
D15 +RHV +HV D1N4753
D17 -HV -RHV D1N4753
XU2 +RHV N017 +RLV +RLV LM317_TRANS  ; pins IN ADJ OUT_0 OUT_1
D11 N017 +RLV 1N4007
R3 +RLV N017 240
R4 N017 GND 2.64k
C9 +RLV GND 1µ
C10 +RHV GND 1µ
D12 -RLV N022 1N4007
R5 -RLV N022 240
R6 N022 GND 2.64k
C12 GND -RLV 1µ
XU4 -RHV N022 -RLV LM337_N_TRANS  ; pins IN ADJ OUT
C13 N017 GND 0.1µ
C14 +RHV GND 0.1µ
C15 GND -RHV 1µ
C16 -RHV GND 0.1µ
C17 N022 GND 0.1µ
D13 +RLV +RHV D1N4753
D14 -RHV -RLV D1N4753
V§LVLIN1 LVLIN1 GND SINE(0 {LVINPEAK} 50)
D5 LVLIN1 N013 1N5408
D6 LVLIN2 N013 1N5408
CFPLV N013 GND 4700µ V=35 Irms=1.45 Rser=0.044 Lser=0 mfg="Nichicon" pn="UPR1V222MRH" type="Al electrolytic"
CFPLVHF N013 GND 0.1µ V=4 Irms=1.62 Rser=0.0464862 Lser=0 mfg="KEMET" pn="C0402C104K7PAC" type="X5R"
D7 N019 LVLIN1 1N5408
D8 N019 LVLIN2 1N5408
V§LVLIN2 GND LVLIN2 SINE(0 {LVINPEAK} 50)
CFNLV GND N019 4700µ V=35 Irms=1.45 Rser=0.044 Lser=0 mfg="Nichicon" pn="UPR1V222MRH" type="Al electrolytic"
CFNLVHF GND N019 0.1µ V=4 Irms=1.62 Rser=0.0464862 Lser=0 mfg="KEMET" pn="C0402C104K7PAC" type="X5R"
C_D5 LVLIN1 N013 0.1µ V=4 Irms=1.62 Rser=0.0464862 Lser=0 mfg="KEMET" pn="C0402C104K7PAC" type="X5R"
C_D6 N013 LVLIN2 0.1µ V=4 Irms=1.62 Rser=0.0464862 Lser=0 mfg="KEMET" pn="C0402C104K7PAC" type="X5R"
C_D7 LVLIN1 N019 0.1µ V=4 Irms=1.62 Rser=0.0464862 Lser=0 mfg="KEMET" pn="C0402C104K7PAC" type="X5R"
C_D8 N019 LVLIN2 0.1µ V=4 Irms=1.62 Rser=0.0464862 Lser=0 mfg="KEMET" pn="C0402C104K7PAC" type="X5R"
VMEAS1 +HV N003 0
VMEAS2 -HV N009 0
VMEAS3 +LV N015 0
VMEAS4 -LV N021 0
Q1 N005 N004 N001 0 BC327-25
R9 N002 N001 0.18
R10 N002 N004 10k
R11 N005 GND 8.2k
D16 N005 N002 PTZ12B
R13 N012 N007 0.18
R14 N012 N010 10k
R15 N008 GND 8.2k
D18 N012 N008 PTZ12B
Q2 N008 N010 N007 0 BC337-25
M1 N003 N005 N002 N002 RSJ250P10
M2 N009 N008 N012 N012 SUM40N10-30
Q3 N018 N016 N013 0 BC327-25
R17 N014 N013 0.56
R18 N014 N016 10k
R19 N018 GND 8.2k
D19 N018 N014 PTZ12B
R20 N024 N019 0.56
R21 N024 N023 10k
R22 N020 GND 8.2k
D20 N024 N020 PTZ12B
Q4 N020 N023 N019 0 BC337-25
M3 N015 N018 N014 N014 RSJ250P10
M4 N021 N020 N024 N024 SUM40N10-30
.model D D
.lib standard.dio
.model NPN NPN
.model PNP PNP
.lib standard.bjt
.model NMOS NMOS
.model PMOS PMOS
.lib standard.mos
* From transformer
.tran 0 100m 0 0.1m
.lib "1N4007.lib"
* Directives
.lib "1N5408.lib"
.lib "1N4753.lib"
.param HTRAFOEFF=40
.param LTRAFOEFF=15
.param LINELEVEL={NORMALLINELEVEL}
* Tensión de línea(220V  -20%/+10%):
* 176V a 242V => 0.8 a 1.1
.param MAXLINELEVEL=1.1
.param MINLINELEVEL=0.8
.param NORMALLINELEVEL=1
.param HVINPEAK=LINELEVEL*SQRT(2)*HTRAFOEFF
.param LVINPEAK=LINELEVEL*SQRT(2)*LTRAFOEFF
.lib "BC548B.lib"
.lib "BC558B.lib"
.lib "TIP41C.lib"
.lib "TIP42C.lib"
* From transformer
.lib "BD137.lib"
.lib "BD138.lib"
.lib LM317_TRANS.LIB
.lib LM337_N_TRANS.LIB
.backanno
.end